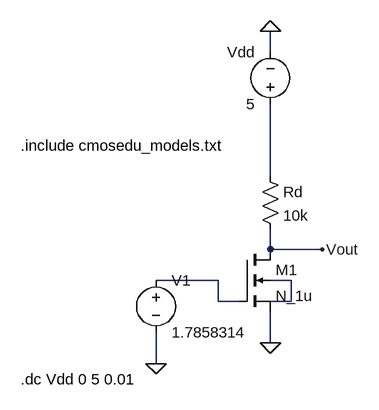
[diagram p0: schematic Parte7.asc]
Parte7.asc, the LTspice schematic file:
Version 4
SHEET 1 880 680
WIRE 144 -176 144 -208
WIRE 144 16 144 -96
WIRE 144 128 144 96
WIRE 224 128 144 128
WIRE 64 176 -32 176
WIRE 176 176 144 176
WIRE 64 208 64 176
WIRE 96 208 64 208
WIRE 176 208 176 176
WIRE 176 208 144 208
WIRE 144 272 144 224
WIRE -32 304 -32 256
FLAG -32 304 0
FLAG 144 272 0
FLAG 224 128 Vout
FLAG 144 -208 0
SYMBOL nmos4 96 128 R0
SYMATTR InstName M1
SYMATTR Value N_1u
SYMATTR Value2 l=1.5u w=9.23u
SYMBOL res 128 0 R0
SYMATTR InstName Rd
SYMATTR Value 10k
SYMBOL voltage -32 160 R0
SYMATTR InstName V1
SYMATTR Value 1.7858314
SYMBOL voltage 144 -80 R180
WINDOW 0 24 96 Left 2
WINDOW 3 24 16 Left 2
SYMATTR InstName Vdd
SYMATTR Value 5
TEXT -240 -32 Left 2 !.include cmosedu_models.txt
TEXT -240 328 Left 2 !.dc Vdd 0 5 0.01

The netlist it stands for:
* Parte7.asc
M1 Vout N002 0 N003 N_1u l=1.5u w=9.23u
Rd N001 Vout 10k
V1 N002 0 1.7858314
Vdd N001 0 5
.model NMOS NMOS
.model PMOS PMOS
.lib standard.mos
.include cmosedu_models.txt
.dc Vdd 0 5 0.01
.backanno
.end